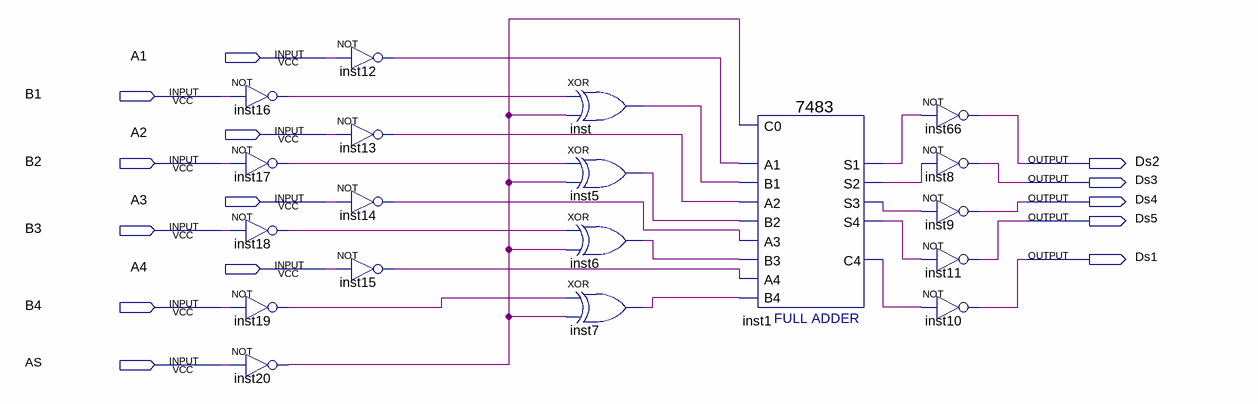
[diagram p0: schematic sheet]
// Quartus schematic 180601_4bits_7483.bdf as structural Verilog: 19 symbols, 14 pins
module \180601_4bits_7483  (
  input  A1,
  input  B1,
  input  A2,
  input  B2,
  input  A3,
  input  B3,
  input  A4,
  input  B4,
  input  AS,
  output Ds2,
  output Ds3,
  output Ds4,
  output Ds5,
  output Ds1
);

  wire inst1_c4, inst1_s1, inst1_s2, inst1_s3, inst1_s4, inst5_out, inst6_out, inst7_out, inst12_out,
       inst13_out, inst14_out, inst15_out, inst16_out, inst17_out, inst18_out, inst19_out, inst20_out,
       inst_out;

  not inst16 (inst16_out, B1);
  not inst17 (inst17_out, B2);
  not inst18 (inst18_out, B3);
  not inst19 (inst19_out, B4);
  not inst20 (inst20_out, AS);
  not inst12 (inst12_out, A1);
  not inst13 (inst13_out, A2);
  not inst14 (inst14_out, A3);
  not inst15 (inst15_out, A4);
  xor inst (inst_out, inst16_out, inst20_out);
  xor inst5 (inst5_out, inst17_out, inst20_out);
  xor inst6 (inst6_out, inst18_out, inst20_out);
  xor inst7 (inst7_out, inst19_out, inst20_out);
  \7483  inst1 (
    .B4(inst7_out), .C0(inst20_out), .A1(inst12_out), .A2(inst13_out), .B1(inst_out), .B2(inst5_out),
    .A3(inst14_out), .B3(inst6_out), .A4(inst15_out), .S3(inst1_s3), .S4(inst1_s4), .S2(inst1_s2),
    .C4(inst1_c4), .S1(inst1_s1));
  not inst66 (Ds2, inst1_s1);
  not inst8 (Ds3, inst1_s2);
  not inst9 (Ds4, inst1_s3);
  not inst11 (Ds5, inst1_s4);
  not inst10 (Ds1, inst1_c4);
endmodule
